# Altium schematic sheet CrySCHE.SchDoc
size A; SheetNumber: 1; SheetTotal: 1; SPICEModelCacheMKGIAEVZ: <root> / <DocumentId>MKGIAEVZ</DocumentId> / <CacheFrame Number="0"> / <Model Name="njfet" Kind="MDL"> / <Text>*Default N-Ch J-FET pkg:TO-92B 3,1,2 / *NJFET Pinout: 1=D, 2=G, 3=S / .MODEL NJFET NJF()</Text> / </Model> / </CacheFrame> / </root>
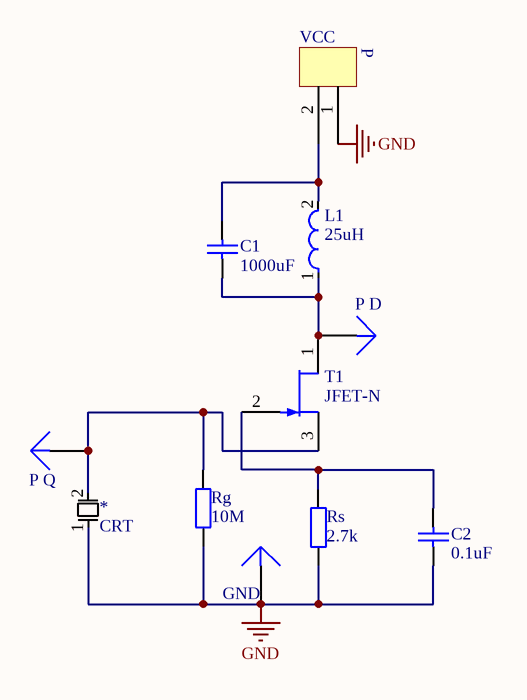
[diagram p0: CrySCHE.SchDoc]

## Parts
*  CRT  [PCBComponent_1]
C1  value 1000uF  [RAD-0.3]  (hidden comment: Cap)
C2  value 0.1uF  [RAD-0.3]  (hidden comment: Cap)
GND  (no value)  [PIN1]
L1  25uH  [FP-FIT50-7-MFG]
P_D  (no value)  [PIN1]
P_Q  (no value)  [PIN1]
Rg  value 10M  [AXIAL-0.4]  (hidden comment: Res2)
Rs  value 2.7k  [AXIAL-0.4]  (hidden comment: Res2)
T1  JFET-N  [TO-254-AA]
VCC  HeaderCustom1x1  [PCBComponent_1]  (value not drawn)

## Nets
GND: *.1 C2.1 GND.1 Rg.1 Rs.1 VCC.1
Net*_2: *.2 P_Q.1 Rg.2 T1.3(S)
NetC1_1: C1.1 L1.1 P_D.1 T1.1(D)
NetC1_2: C1.2 L1.2 VCC.2
NetC2_2: C2.2 Rs.2 T1.2(G)

## Notes on the sheet
- (in symbol CMP-041-000000-2) P

## Library data of the parts
* = CMP-039-000001-1: Source: Crist1Mhz.SchLib; Design Item ID: Component_1
C1 C2 = CMP-001-00083-1: Capacitor; Case/Package: Radial Cap, Thru-Hole; 2 Leads; 0.3 in Pin Spacing; Published: 8-Jun-2000; PackageReference: RAD-0.3; Design Item ID: Cap; Publisher: Altium Limited; Source: Miscellaneous Devices.SchLib; LatestRevisionDate: 17-Jul-2002; Pins: 2; LatestRevisionNote: Re-released for DXP Platform.; Component Type: Standard; Signal Integrity: Cap
GND P_D P_Q = CMP-022-000003-1: Plug; Signal Integrity: Connector; LatestRevisionDate: 17-Jul-2002; Publisher: Altium Limited; Source: Miscellaneous Connectors.SchLib; Pin Count: 1; Design Item ID: Plug; LatestRevisionNote: Re-released for DXP Platform.; Component Type: Standard
L1 = CMP-75789-000001-1: FIXED IND 8.86UH 8.1A 11 MOHM TH; Shielding: Unshielded; Resistance: 0.011R; Test Frequency: 10kHz; Tolerance: 10%; DC Resistance (DCR): 11mR; Termination: Through Hole; Current Rating: 8.1A; Mount: Through Hole; Weight: 0.192oz; Packaging: Bulk; Height: 0.75inch; Width: 0.475inch; Case/Package: Radial; Length: 0.7inch; Package Quantity: 1; Lead Pitch: 7.62mm; Lead Free: Lead Free; Inductance: 8.86uH; RoHS Compliant: Yes; Series: FIT; Number of Pins: 2; Max DC Current: 8.1A
Rg Rs = CMP-009-00190-1: Resistor; Signal Integrity: Res; Published: 8-Jun-2000; Case/Package: Axial Device, Thru-Hole; 2 Leads; 0.4 in Pin Spacing; Publisher: Altium Limited; LatestRevisionDate: 17-Jul-2002; Source: Miscellaneous Devices.SchLib; Pins: 2; LatestRevisionNote: Re-released for DXP Platform.; PackageReference: AXIAL-0.4; Component Type: Standard; Design Item ID: Res2
T1 = CMP-019-000008-1: N-Channel JFET; Code_JEDEC: TO-254-AA; Design Item ID: JFET-N; LatestRevisionDate: 17-Jul-2002; Pin Count: 3; Source: Miscellaneous Devices.SchLib; Component Type: Standard; Publisher: Altium Limited; PackageReference: TO-254-AA; LatestRevisionNote: Re-released for DXP Platform.; Published: 8-Jun-2000
VCC = CMP-041-000000-2: Source: HeaderCustom0_5.SchLib; Design Item ID: Component_1